# Altium schematic sheet SiPM_Smart_Probe.SchDoc: SiPM Smart Probe
size A4; Author: Ondrej Ruzicka; Revision: revA; SheetNumber: 1; SheetTotal: 1; Subtitle: -; Number: [NUMBER]; ProjectName: [PROJECT NAME]
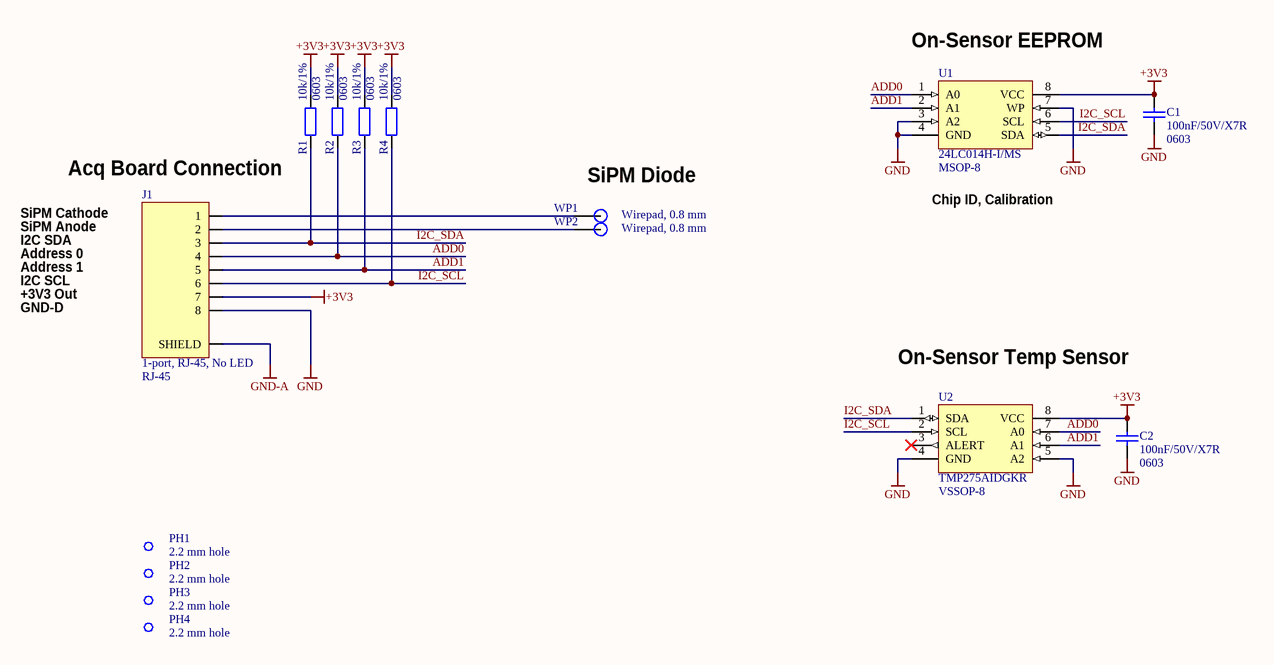
[diagram p0: SiPM_Smart_Probe.SchDoc]

## Parts
C1  100nF/50V/X7R  Package: 0603  [sm_cap_0603]
C2  100nF/50V/X7R  Package: 0603  [sm_cap_0603]
J1  1-port, RJ-45, No LED  Package: RJ-45  [RJ45_1_PORT_NOLED]
PH1  2.2 mm hole  [c480h220]
PH2  2.2 mm hole  [c480h220]
PH3  2.2 mm hole  [c480h220]
PH4  2.2 mm hole  [c480h220]
R1  10k/1%  Package: 0603  [sm_res_0603]
R2  10k/1%  Package: 0603  [sm_res_0603]
R3  10k/1%  Package: 0603  [sm_res_0603]
R4  10k/1%  Package: 0603  [sm_res_0603]
U1  24LC014H-I/MS  [MSOP-8]
U2  TMP275AIDGKR  [VSSOP-8]
WP1  Wirepad, 0.8 mm  [Wirepad_0.8MM]
WP2  Wirepad, 0.8 mm  [Wirepad_0.8MM]

## Nets
+3V3: C1.2 C2.2 J1.7 R1.2 R2.2 R3.2 R4.2 U1.8(VCC) U2.8(VCC)
GND: C1.1 C2.1 J1.8 U1.3(A2) U1.4(GND) U1.7(WP) U2.4(GND) U2.5(A2)
GND-A: J1.SHIELD
ADD0: J1.4 R2.1 U1.1(A0) U2.7(A0)
ADD1: J1.5 R3.1 U1.2(A1) U2.6(A1)
I2C_SCL: J1.6 R4.1 U1.6(SCL) U2.2(SCL)
I2C_SDA: J1.3 R1.1 U1.5(SDA) U2.1(SDA)
NetJ1_1: J1.1 WP1.1
NetJ1_2: J1.2 WP2.1

Not connected (* = marked no-connect by the designer): PH1 1; PH2 1; PH3 1; PH4 1; U2 3(ALERT)*

## Notes on the sheet
- (near U1) On-Sensor EEPROM
- SiPM Cathode
- Acq Board Connection
- SiPM Diode
- Chip ID, Calibration
- SiPM Anode
- I2C SDA
- Address 0
- Address 1
- I2C SCL
- +3V3 Out
- GND-D
- On-Sensor Temp Sensor
- Size:
- A4
- Date:
- Title:
- Author:
- Time:
- Revision:
- Subtitle:
- Notes:
- Sheet:
- of

## Library data of the parts
C1 C2 = Capacitor_0603_100n_50V_X7R: MLCC capacitor, non-polarized; Manufacturer: Yageo; Part Number: CC0603KRX7R9BB104; Link: https://cz.mouser.com/ProductDetail/Yageo/CC0603KRX7R9BB104?qs=sGAEpiMZZMvsSlwiRhF8qgFnKIgZe697WZ9nrpNTeGg%3D; Distributor: Mouser
J1 = RJ45_1_PORT_NOLED: Manufacturer: Amphenol; Part Number: RJSBE5380C1; Link: https://cz.mouser.com/ProductDetail/Amphenol-Commercial-Products/RJSBE5380C1?qs=LiXFYW4OVo%2FdVDofBGy8HQ%3D%3D; Distributor: Mouser
PH1-PH4 = PLATED_HOLE2.2_PAD4.8
R1-R4 = Resistor_0603_10k_1%: Chip resistor; Manufacturer: Yageo; Part Number: RC0603FR-0710KL; Link: https://cz.mouser.com/ProductDetail/Yageo/RC0603FR-0710KL?qs=sGAEpiMZZMtlubZbdhIBIAhzU1Tw%252BHVakiDuQ4Zki0U%3D; Distributor: Mouser
U1 = 24LC014H-I/MS: I2C EEPROM 1K 128x8; Manufacturer: Microchip Technology; Link: https://cz.mouser.com/ProductDetail/Microchip-Technology/24LC014H-I-MS?qs=hH%252BOa0VZEiBOWodxna96qw%3D%3D; Distributor: Mouser; Part Number: 24LC014H-I/MS; Package: MSOP-8
U2 = TMP275: I2C ±0.5°C Temperature Sensor; Manufacturer: Texas Instruments; Link: https://cz.mouser.com/ProductDetail/Texas-Instruments/TMP275AIDGKR?qs=RnzODY3cU8v9LWMH5YW1eQ%3D%3D&utm_id=20109199427&gad_source=1&gclid=CjwKCAjwhIS0BhBqEiwADAUhc0_SASKqB-PLyWTqpads6ibLibyqbTwsBhDKT4CGQp2hdobwB620EhoCWvAQAvD_BwE; Distributor: Mouser; Part Number: TMP275AIDGKR; Package: VSSOP-8
WP1 WP2 = Wirepad_0.8MM